# Altium schematic sheet 功放TDA2030.SchDoc
size A4
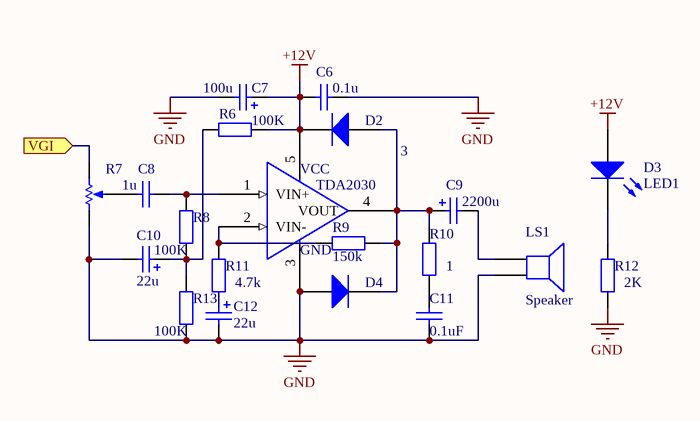
[diagram p0: 功放TDA2030.SchDoc]

## Parts
3  TDA2030  [TDA2030]
C6  瓷片电容  [瓷片电容]  (value not drawn)
C7  电解电容  [电解电容]  (value not drawn)
C8  独石电容  [独石电容]  (value not drawn)
C9  电解电容  [电解电容]  (value not drawn)
C10  电解电容  [电解电容]  (value not drawn)
C11  瓷片电容  [瓷片电容]  (value not drawn)
C12  电解电容  [电解电容]  (value not drawn)
D2  Diode 1N4007  [DO-41]  (value not drawn)
D3  LED1  [LED-1]
D4  Diode 1N4007  [DO-41]  (value not drawn)
LS1  Speaker  [PIN2]
R6  value 100K  [AXIAL-0.4]  (hidden comment: Res2)
R7  滑阻（功放用）  [多角滑阻]  (value not drawn)
R8  value 100K  [AXIAL-0.4]  (hidden comment: Res2)
R9  value 150k  [AXIAL-0.4]  (hidden comment: Res2)
R10  value 1  [AXIAL-0.4]  (hidden comment: Res2)
R11  value 4.7k  [AXIAL-0.4]  (hidden comment: Res2)
R12  value 2K  [AXIAL-0.4]  (hidden comment: Res2)
R13  value 100K  [AXIAL-0.4]  (hidden comment: Res2)

## Ports
VGI (in)

## Nets
+12V: 3.5(VCC) C6.1 C7.1 D2.2(K) D3.1(A) R6.2
GND: 3.3(GND) C6.2 C7.2 C10.2 C11.1 C12.2 D4.1(A) LS1.2 R7.1 R12.1 R13.1
VGI: R7.3 ; port VGI
Net3_1: 3.1(VIN+) C8.2 R8.2
Net3_2: 3.2(VIN-) R9.2 R11.2
Net3_4: 3.4(VOUT) C9.1 D2.1(A) D4.2(K) R9.1 R10.2
NetC8_1: C8.1 R7.2(TAP)
NetC9_2: C9.2 LS1.1
NetC10_1: C10.1 R6.1 R8.1 R13.2
NetC11_2: C11.2 R10.1
NetC12_1: C12.1 R11.1
NetD3_2: D3.2(K) R12.2

## Notes on the sheet
- 标题
- 日期
- 红外数字模拟接收一体机
- 2015 5 29
- 作者
- 模电组
- 单位
- 电子技术协会
- (in symbol 独石电容) 1u
- (in symbol 瓷片电容) 0.1u; 0.1uF
- (in symbol 电解电容) 100u; 22u; 2200u

## Library data of the parts
D2 D4 = Diode 1N4007: 1 Amp General Purpose Rectifier; Published: 8-Jun-2000; LatestRevisionDate: 17-Jul-2002; LatestRevisionNote: Re-released for DXP Platform.; DatasheetDocument: 1998; PackageDocument: Aug-1999; PackageReference: DO-41; Publisher: Altium Limited; Code_JEDEC: DO-204-AL; ComponentLink1Description: Manufacturer Link; ComponentLink1URL: http://www.fairchildsemi.com/; ComponentLink2Description: Datasheet; ComponentLink2URL: http://www.fairchildsemi.com/ds/1N%2F1N4001.pdf
D3 = LED1: Typical RED GaAs LED; Published: 8-Jun-2000; LatestRevisionDate: 08-Jul-2005; LatestRevisionNote: Mech Layer 1 removed.; PackageReference: LED-1; Publisher: Altium Limited
LS1 = Speaker: Loudspeaker; Published: 24-Mar-1999; LatestRevisionDate: 17-Jul-2002; LatestRevisionNote: Re-released for DXP Platform.; PackageReference: PIN2; Publisher: Altium Limited
R6 R8-R13 = Res2: Resistor; Published: 8-Jun-2000; LatestRevisionDate: 17-Jul-2002; LatestRevisionNote: Re-released for DXP Platform.; PackageReference: AXIAL-0.4; Publisher: Altium Limited